# EAGLE design PCB_Cajero_10 (EAGLE 8.6.3)
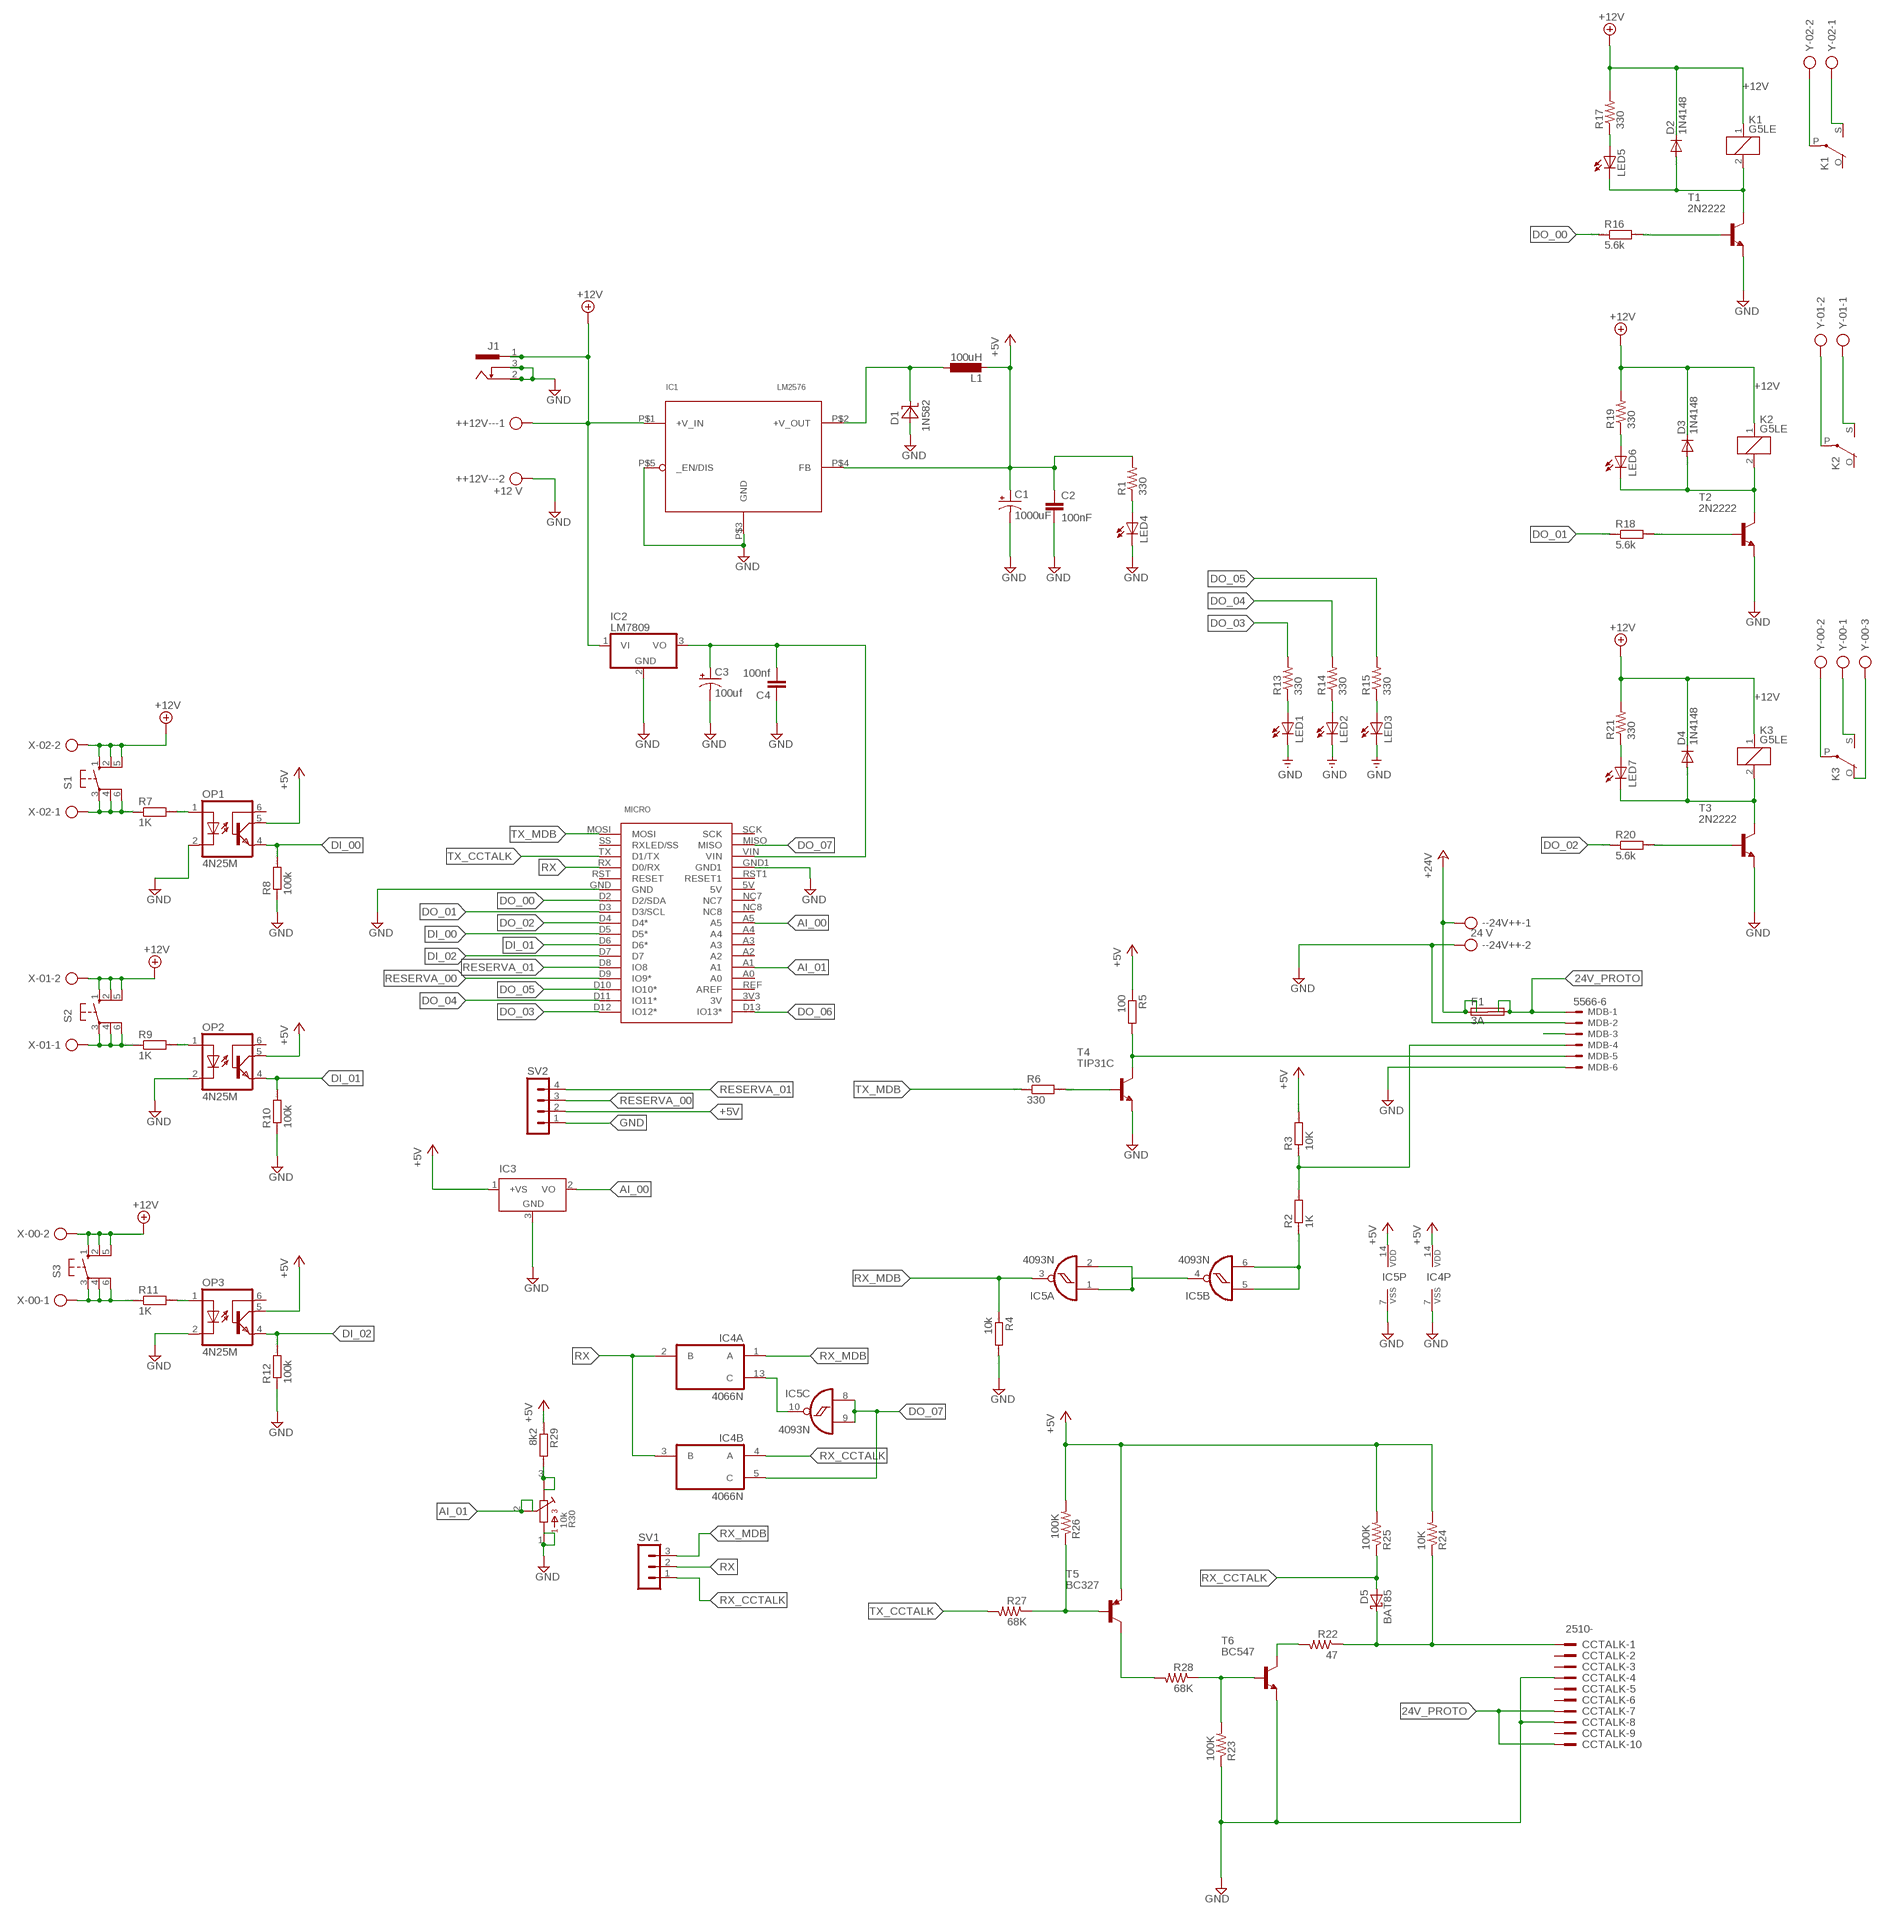
[diagram p0: schematic, sheet 1]

## Parts
++12V--  +12 V  AK500/2  [AK500/2]
--24V++  24 V  AK500/2  [AK500/2]
C1  1000uF  CPOL-USE5-5  [E5-5]
C2  100nF  C2,5-3  [C2.5-3]
C3  100uf  CPOL-USE2.5-6  [E2,5-6]
C4  100nf  C2,5-3  [C2.5-3]
CCTALK  2510-  [PAK100/2500-10]
D1  1N582  [1N582*]
D2  1N4148  1N4148DO35-7  [DO35-7]
D3  1N4148  1N4148DO35-7  [DO35-7]
D4  1N4148  1N4148DO35-7  [DO35-7]
D5  BAT85  [SOD68]
F1  3A  SHK20L  [SHK20L]
IC1  LM2576  LM2576-T05E  [TO220_SEP]
IC2  LM7809  [TO-220V]
IC3  LM35CZ  [TO92]
IC4  4066N  [DIL14]
IC5  4093N  [DIL14]
J1  KLDVX-0202-A  [KLDVX-0202-A]
K1  G5LE  [G5LE]
K2  G5LE  [G5LE]
K3  G5LE  [G5LE]
L1  100uH  DO3316P  [DO3316P]
LED1  LED5MM  [LED5MM]
LED2  LED5MM  [LED5MM]
LED3  LED5MM  [LED5MM]
LED4  LED5MM  [LED5MM]
LED5  LED5MM  [LED5MM]
LED6  LED5MM  [LED5MM]
LED7  LED5MM  [LED5MM]
MDB  5566-6  [5566-6]
MICRO  ARDUINO_MICROFOOTPRINT  [ARDUINO-MICRO]
OP1  4N25M  [DIL06]
OP2  4N25M  [DIL06]
OP3  4N25M  [DIL06]
R1  330  R-US_0207/7  [0207/7]
R2  1K  R0204/7  [0204/7]
R3  10K  R0204/7  [0204/7]
R4  10k  R0204/7  [0204/7]
R5  100  R-EU_0309/10  [0309/10]
R6  330  R0204/7  [0204/7]
R7  1K  R0204/7  [0204/7]
R8  100k  R0204/7  [0204/7]
R9  1K  R0204/7  [0204/7]
R10  100k  R0204/7  [0204/7]
R11  1K  R0204/7  [0204/7]
R12  100k  R0204/7  [0204/7]
R13  330  R-US_0207/7  [0207/7]
R14  330  R-US_0207/7  [0207/7]
R15  330  R-US_0207/7  [0207/7]
R16  5.6k  R0204/7  [0204/7]
R17  330  R-US_0207/7  [0207/7]
R18  5.6k  R0204/7  [0204/7]
R19  330  R-US_0207/7  [0207/7]
R20  5.6k  R0204/7  [0204/7]
R21  330  R-US_0207/7  [0207/7]
R22  47  R-US_0204/7  [0204/7]
R23  100K  R-US_0204/7  [0204/7]
R24  10K  R-US_0204/7  [0204/7]
R25  100K  R-US_0204/7  [0204/7]
R26  100K  R-US_0204/7  [0204/7]
R27  68K  R-US_0204/7  [0204/7]
R28  68K  R-US_0204/7  [0204/7]
R29  8k2  R0204/7  [0204/7]
R30  10k  3386  [3386-MULTI]
S1  10-XX  [B3F-10XX]
S2  10-XX  [B3F-10XX]
S3  10-XX  [B3F-10XX]
SV1  MA03-1  [MA03-1]
SV2  MA04-1  [MA04-1]
T1  2N2222  [TO18]
T2  2N2222  [TO18]
T3  2N2222  [TO18]
T4  TIP31C  [TO-220V]
T5  BC327  [TO92]
T6  BC547  [TO92]
X-00  AK500/2  [AK500/2]
X-01  AK500/2  [AK500/2]
X-02  AK500/2  [AK500/2]
Y-00  AK500/3  [AK500/3]
Y-01  AK500/2  [AK500/2]
Y-02  AK500/2  [AK500/2]

## Nets
24V_PROTO: CCTALK.7 CCTALK.10 F1.2A F1.2B MDB.1
+5V: C1.+ C2.1 IC1.P$4(FB) IC3.1(+VS) IC4.14(P:VDD) IC5.14(P:VDD) L1.1 OP1.5(COL) OP2.5(COL) OP3.5(COL) R1.2 R3.2 R5.1 R24.2 R25.2 R26.2 R29.1 SV2.2 T5.1(E)
+12V: ++12V--.1 D2.C D3.C D4.C IC1.P$1(+V_IN) IC2.1(VI) J1.1 J1.1@1 K1.1 K2.1 K3.1 R17.2 R19.2 R21.2 S1.1(S) S1.2(S1) S1.5(S2) S2.1(S) S2.2(S1) S2.5(S2) S3.1(S) S3.2(S1) S3.5(S2) X-00.2 X-01.2 X-02.2
+24V: --24V++.1 F1.1A F1.1B
AI_00: IC3.2(VO) MICRO.A5
AI_01: MICRO.A1 R30.2 R30.5
DI_00: MICRO.D5(D5*) OP1.4(EMI) R8.2
DI_01: MICRO.D6(D6*) OP2.4(EMI) R10.2
DI_02: MICRO.D7 OP3.4(EMI) R12.2
DO_00: MICRO.D2(D2/SDA) R16.1
DO_01: MICRO.D3(D3/SCL) R18.1
DO_02: MICRO.D4(D4*) R20.1
DO_03: MICRO.D12(IO12*) R13.2
DO_04: MICRO.D11(IO11*) R14.2
DO_05: MICRO.D10(IO10*) R15.2
DO_06: MICRO.D13(IO13*)
DO_07: IC4.5(B:C) IC5.8(C:I0) IC5.9(C:I1) MICRO.MISO
GND: ++12V--.2 --24V++.2 C1.- C2.2 C3.- C4.1 CCTALK.4 CCTALK.8 D1.A IC1.P$3(GND) IC1.P$5(_EN/DIS) IC2.2(GND) IC3.3(GND) IC4.7(P:VSS) IC5.7(P:VSS) J1.2 J1.2@1 J1.3 J1.3@1 LED1.K(C) LED2.K(C) LED3.K(C) LED4.K(C) MDB.2 MDB.6 MICRO.GND MICRO.GND1 OP1.2(C) OP2.2(C) OP3.2(C) R4.2 R8.1 R10.1 R12.1 R23.1 R30.1 R30.4 SV2.1 T1.1(E) T2.1(E) T3.1(E) T4.3(E) T6.1(E)
N$1: C3.+ C4.2 IC2.3(VO) MICRO.VIN
N$2: R7.1 S1.3(P) S1.4(P1) S1.6(P2) X-02.1
N$3: R9.1 S2.3(P) S2.4(P1) S2.6(P2) X-01.1
N$4: D3.A K2.2 LED6.K(C) T2.3(C)
N$5: K2.P(2:P) Y-01.2
N$7: MDB.3
N$8: LED4.A R1.1
N$9: D1.C IC1.P$2(+V_OUT) L1.2
N$10: LED5.A R17.1
N$11: OP1.1(A) R7.2
N$12: K2.S(2:S) Y-01.1
N$13: LED1.A R13.1
N$14: LED2.A R14.1
N$15: LED3.A R15.1
N$16: R18.2 T2.2(B)
N$17: LED6.A R19.1
N$18: OP2.1(A) R9.2
N$19: R11.1 S3.3(P) S3.4(P1) S3.6(P2) X-00.1
N$20: R29.2 R30.3 R30.6
N$21: CCTALK.1 D5.C(K) R22.1 R24.1
N$22: OP3.1(A) R11.2
N$23: R16.2 T1.2(B)
N$25: IC5.1(A:I0) IC5.2(A:I1) IC5.4(B:O)
N$26: D4.A K3.2 LED7.K(C) T3.3(C)
N$27: D2.A K1.2 LED5.K(C) T1.3(C)
N$28: K1.P(2:P) Y-02.2
N$29: K1.S(2:S) Y-02.1
N$30: R22.2 T6.3(C)
N$31: K3.P(2:P) Y-00.2
N$32: R23.2 R28.1 T6.2(B)
N$33: R28.2 T5.3(C)
N$34: MDB.5 R5.2 T4.2(C)
N$35: R6.2 T4.1(B)
N$36: IC5.5(B:I0) IC5.6(B:I1) R2.1
N$37: MDB.4 R2.2 R3.1
N$38: K3.S(2:S) Y-00.1
N$39: R26.1 R27.1 T5.2(B)
N$40: R20.2 T3.2(B)
N$41: LED7.A R21.1
N$42: IC4.13(A:C) IC5.10(C:O)
N$44: K3.O(2:O) Y-00.3
RESERVA_00: MICRO.D9(IO9*) SV2.3
RESERVA_01: MICRO.D8(IO8) SV2.4
RX: IC4.2(A:B) IC4.3(B:B) MICRO.RX(D0/RX) SV1.2
RX_CCTALK: D5.A IC4.4(B:A) R25.1 SV1.1
RX_MDB: IC4.1(A:A) IC5.3(A:O) R4.1 SV1.3
TX_CCTALK: MICRO.TX(D1/TX) R27.2
TX_MDB: MICRO.MOSI R6.1
Unconnected: CCTALK.2 CCTALK.3 CCTALK.5 CCTALK.6 CCTALK.9 IC4.6(C:C) IC4.8(C:A) IC4.9(C:B) IC4.10(D:B) IC4.11(D:A) IC4.12(D:C) IC5.11(D:O) IC5.12(D:I0) IC5.13(D:I1) K1.O(2:O) K2.O(2:O) MICRO.3V3(3V) MICRO.5V MICRO.A0 MICRO.A2 MICRO.A3 MICRO.A4 MICRO.NC7 MICRO.NC8 MICRO.REF(AREF) MICRO.RST1(RESET1) MICRO.RST(RESET) MICRO.SCK MICRO.SS(RXLED/SS) OP1.6(BAS) OP2.6(BAS) OP3.6(BAS)

## Library data of the parts
++12V-- --24V++ X-00 X-01 X-02 Y-01 Y-02 = con-ptr500:AK500/2: CONNECTOR; OC_FARNELL: unknown; OC_NEWARK: unknown
C1 = rcl:CPOL-US: POLARIZED CAPACITOR, American symbol; SPICEPREFIX: C
C2 C4 = capacitor-wima:C: CAPACITOR naming: grid - package width
C3 = adafruit:CPOL-US: POLARIZED CAPACITOR, American symbol
CCTALK = con-3m:2510-: 3M (TM) Pak 100 4-Wall Header Source: 3M; MF: 3M; MPN: 2510-6002UB; OC_FARNELL: 9838244; OC_NEWARK: 46F4725
D1 = MOD:1N582*
D2-D4 = diode:1N4148: DIODE high speed (Philips)
D5 = nxp_60:BAT85: Schottky barrier diode Planar Schottky barrier diode with an integrated protection ring against static discharges, encapsulated in a hermetically-sealed subminiature SOD68 (DO-34) package. The diode is suitable for mounting on a 2 E (5.08 mm) pitch. AAL Eindhoven MK
F1 = fuse:SHK20L: FUSE HOLDER 5 x 20 mm, SH contact, SHH1 Schukat, E1073 Buerklin; OC_FARNELL: unknown; OC_NEWARK: unknown
IC1 = LM2576_MOD:LM2576-T05E
IC2 = MOD:LM7809
IC3 = lm35:LM35: Single-Supply Centigrade Temperature Sensor Vout = (10mV/°C x Temp °C) +5mmmV Source: http://www.national.com/ds/LM/LM35.pdf
IC4 = 40xx:4066: Quad bilateral ANALOG SWITCH
IC5 = 40xx:4093: Quad 2-input NAND schmitt trigger; SPICEPREFIX: J
J1 = con-kycon:KLDVX-0202-: Power Jack, Vertical, PCB Mount, 2.0 mm, 2.5 mm, 3.0 mm Center Pin Source: KLDVX-0202x.pdf; OC_FARNELL: unknown; OC_NEWARK: unknown
K1-K3 = relay:G5LE: RELAY 1 x switch, 10 A/120 V AC, 8 A/30 V DC, Omron; OC_FARNELL: unknown; OC_NEWARK: unknown
L1 = MOD:DO3316P: COILCRAFT; OC_FARNELL: unknown; OC_NEWARK: unknown
LED1-LED7 = adafruit:LED: LED OSRAM: - CHIPLED LG R971, LG N971, LY N971, LG Q971, LY Q971, LO R971, LY R971 LH N974, LH R974 LS Q976, LO Q976, LY Q976 LO Q996 - Hyper CHIPLED LW Q18S LB Q993, LB Q99A, LB R99A - SideLED LS A670, LO A670, LY A670, LG A670, LP A670 LB A673, LV A673, LT A673, LW A673 LH A674 LY A675 LS A676, LA A676, LO A676, LY A676, LW A676 LS A679, LY A679, LG A679 - Hyper Micro SIDELED® LS Y876, LA Y876, LO Y876, LY Y876 LT Y87S - SmartLED LW L88C, LW L88S LB L89C, LB L89S, LG L890 LS L89K, LO L89K, LY L89K LS L896, LA L896, LO L896, LY L896 - TOPLED LS T670, LO T670, LY T670, LG T670, LP T670 LSG T670, LSP T670, LSY T670, LOP T670, LYG T670 LG T671, LOG T671, LSG T671 LB T673, LV T673, LT T673, LW T673 LH T674 LS T676, LA T676, LO T676, LY T676, LB T676, LH T676, LSB T676, LW T676 LB T67C, LV T67C, LT T67C, LS T67K, LO T67K, LY T67K, LW E67C LS E67B, LA E67B, LO E67B, LY E67B, LB E67C, LV E67C, LT E67C LW T67C LS T679, LY T679, LG T679 LS T770, LO T770, LY T770, LG T770, LP T770 LB T773, LV T773, LT T773, LW T773 LH T774 LS E675, LA E675, LY E675, LS T675 LS T776, LA T776, LO T776, LY T776, LB T776 LHGB T686 LT T68C, LB T68C - Hyper Mini TOPLED® LB M676 - Mini TOPLED Santana® LG M470 LS M47K, LO M47K, LY M47K Source: http://www.osram.convergy.de/
MDB = MOD:5566-6: Mini FIT connector 6 pol Source: http://www.molex.com; MF: MOLEX; MPN: 95566-61002; OC_FARNELL: unknown; OC_NEWARK: 22K8620
MICRO = arduino-micro:ARDUINO_MICRO
OP1-OP3 = optocoupler:4N*?M: General Purpose 6-Pin Phototransistor Optocouplers Source: http://www.fairchildsemi.com/ds/4N/4N35-M.pdf; MPN: 4N25-M; OC_FARNELL: 1021349; OC_NEWARK: 98K9084
R1 R13-R15 R17 R19 R21-R28 = rcl:R-US_: RESISTOR, American symbol; SPICEPREFIX: R
R2-R4 R6-R12 R16 R18 R20 R29 = eagle-ltspice:R: RESISTOR, European symbol; SPICEMODEL: NONE; SPICEPREFIX: R
R5 = rcl:R-EU_: RESISTOR, European symbol; SPICEPREFIX: R
R30 = bourns:3386: 3386 Series 3/8" Square Trimmer (Multi-Package F,P,K & Y)
S1-S3 = MOD:10-XX: OMRON SWITCH; MPN: B3F-1000; OC_FARNELL: 176432; OC_NEWARK: 36M3542
SV1 = con-lstb:MA03-1: PIN HEADER; OC_FARNELL: unknown; OC_NEWARK: unknown
SV2 = con-lstb:MA04-1: PIN HEADER; OC_FARNELL: unknown; OC_NEWARK: unknown
T1-T3 = transistor-neu-to92:2N2222: NPN TRANSISTOR
T4 = MOD:TIP31C
T5 = transistor-pnp:BC327: PNP Transistor
T6 = transistor:BC547: NPN TRANSISTOR
Y-00 = con-ptr500:AK500/3: CONNECTOR; OC_FARNELL: unknown; OC_NEWARK: unknown

## Board
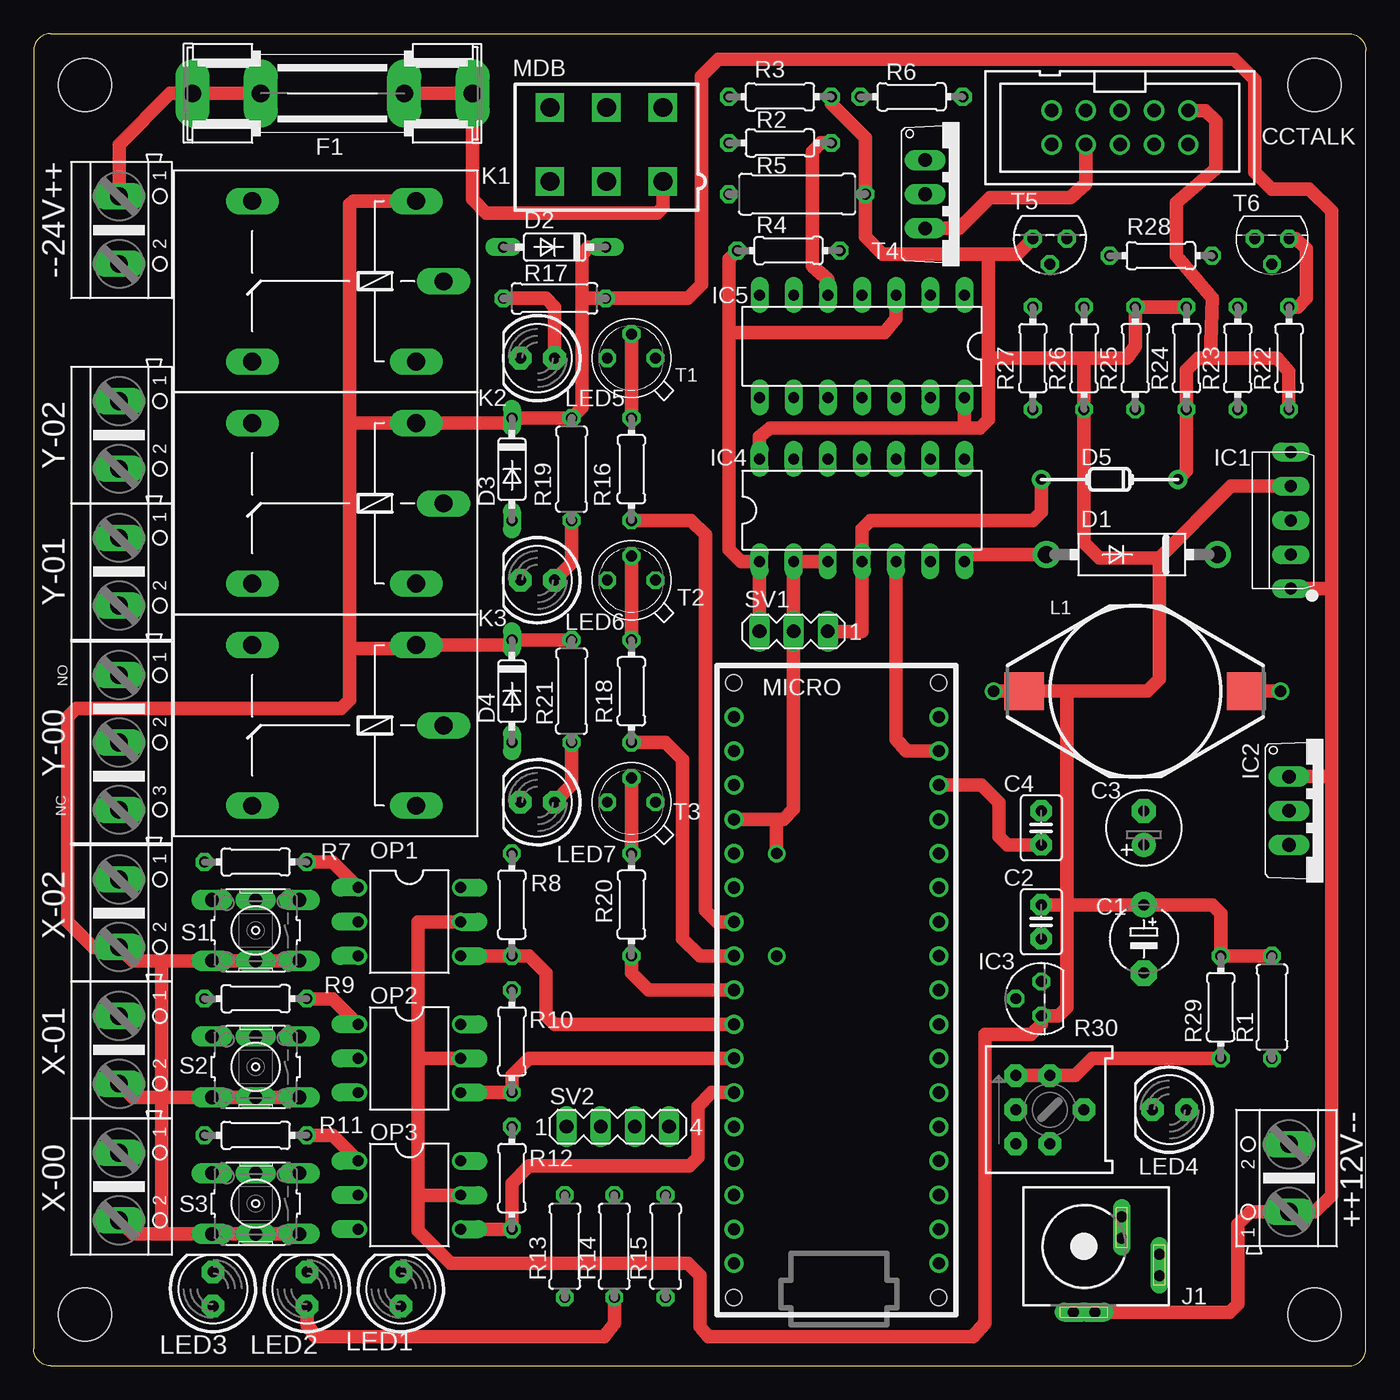
[diagram p1: board, top side]
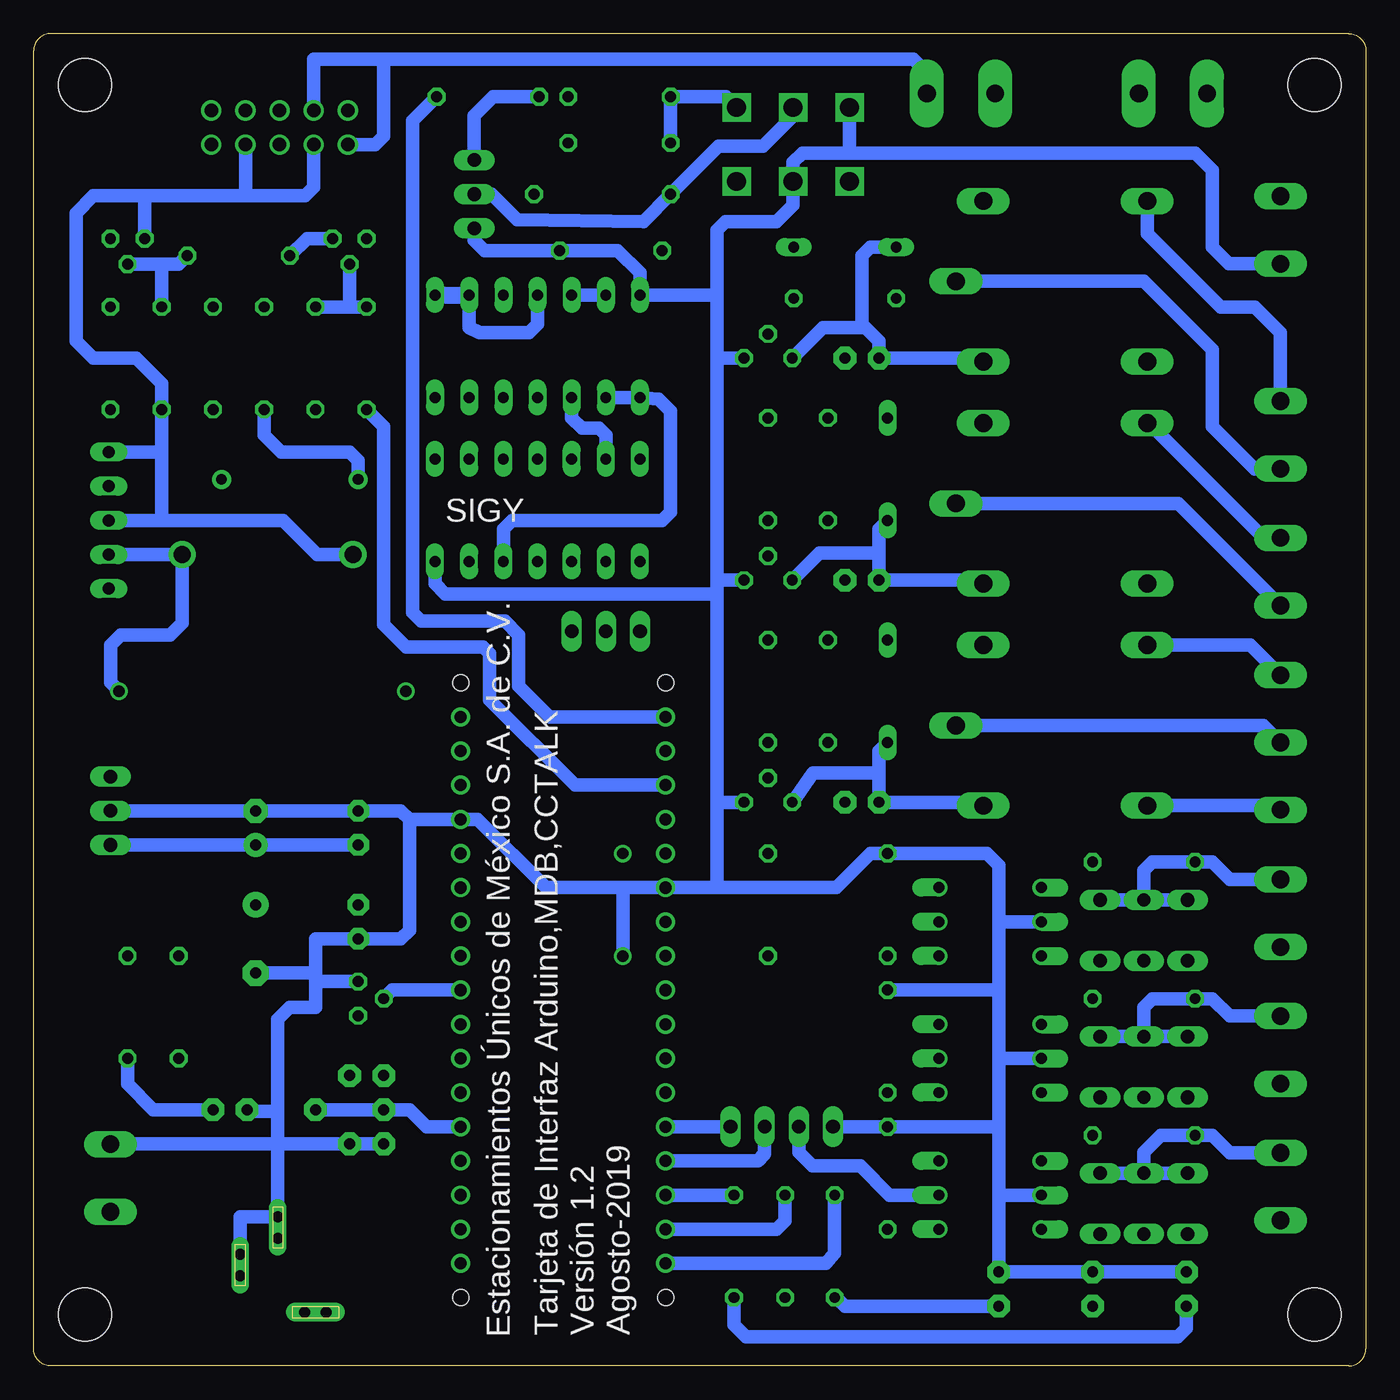
[diagram p2: board, bottom side, seen from below]

Size 99.06 x 99.06 mm. Coordinates in mm from the lower left corner, seen from the top.
Outline: 1.27,0 97.79,0 arc90 99.06,1.27 99.06,97.79 arc90 97.79,99.06 1.27,99.06 arc90 0,97.79 0,1.27 arc90 1.27,0
Copper layers (1*16): Top 0.035mm / dielectric 1.5mm / Bottom 0.035mm
Design rules "default": minimum track width 6mil, minimum drill 0.35mm, track to track 6mil, track to pad 6mil, pad to pad 6mil, via to via 6mil, smd to smd 6mil, copper to edge 40mil, drill to drill 6mil, minimum pad ring 10mil, minimum via ring 8mil, stop-mask expansion 4mil, vias tented up to drill 0mil, thermal gap 10mil
Holes 3.97 mm at 3.81,95.25 95.25,95.25 95.25,3.81 3.81,3.81

### Footprints (pad centres in the part's own frame; a part is rotated, then mirrored left to right if it is on the bottom)
AK500/2 = drill 1.321 long: 1 -2.515,0; 2 2.515,0
E5-5 = drill 0.813 pad 1.905: + -2.54,0 | drill 0.813 pad 1.905 octagon: - 2.54,0
C2.5-3 = drill 0.813 pad 1.6 octagon: 1 -1.27,0; 2 1.27,0
E2,5-6 = drill 0.813 pad 1.778: + -1.27,0 | drill 0.813 pad 1.778 octagon: - 1.27,0
PAK100/2500-10 = drill 1 pad 1.422: 1 -5.08,-1.27; 2 -5.08,1.27; 3 -2.54,-1.27; 4 -2.54,1.27; 5 0,-1.27; 6 0,1.27; 7 2.54,-1.27; 8 2.54,1.27; 9 5.08,-1.27; 10 5.08,1.27
1N582* = drill 1.27 pad 2.032: A 5.08,0; C -7.62,0
DO35-7 = drill 0.813 long: A 3.81,0; C -3.81,0
SOD68 = drill 0.8 pad 1.422: A -5.08,0; C 5.08,0
SHK20L = drill 1.321 pad 2.54 long: 1A -10.414,0; 1B -5.334,0; 2A 10.414,0; 2B 5.334,0
TO220_SEP = drill 0.889 pad 1.219 long: P$1 -5.08,0; P$2 -2.54,0; P$3 0,0; P$4 2.54,0; P$5 5.08,0
TO-220V = drill 1.016 long: 1 -2.54,0; 2 0,0; 3 2.54,0
TO92 = drill 0.813 octagon: 1 -1.27,0; 2 0,1.905; 3 1.27,0
DIL14 = drill 0.813 long: 1 -7.62,-3.81; 2 -5.08,-3.81; 3 -2.54,-3.81; 4 0,-3.81; 5 2.54,-3.81; 6 5.08,-3.81; 7 7.62,-3.81; 8 7.62,3.81; 9 5.08,3.81; 10 2.54,3.81; 11 0,3.81; 12 -2.54,3.81; 13 -5.08,3.81; 14 -7.62,3.81
KLDVX-0202-A = drill 0.8 pad 1.4 long: 1 -4.9,0.8; 1@1 -4.9,-0.8 | drill 0.8 pad 1.3 long: 2 -2.2,-5.6; 2@1 -0.6,-5.6; 3 0.6,-2.8; 3@1 2.2,-2.8
G5LE = drill 1.321 long: 1 -7.493,-5.969; 2 -7.493,5.969; O 4.699,5.969; P -9.525,0; S 4.699,-5.969
DO3316P = smd 2.92 x 2.79: 1 -8.255,0; 2 8.255,0
LED5MM = drill 0.813 pad 1.676 octagon: A -1.27,0; K 1.27,0
5566-6 = drill 1.4 square: 1 4.2,-2.75; 2 0,-2.75; 3 -4.2,-2.75; 4 4.2,2.75; 5 0,2.75; 6 -4.2,2.75
ARDUINO-MICRO = drill 0.9: 3V3 16.51,3.81; 5V 16.51,29.21; A0 16.51,8.89; A1 16.51,11.43; A2 16.51,13.97; A3 16.51,16.51; A4 16.51,19.05; A5 16.51,21.59; D2 1.27,26.67; D3 1.27,24.13; D4 1.27,21.59; D5 1.27,19.05; D6 1.27,16.51; D7 1.27,13.97; D8 1.27,11.43; D9 1.27,8.89; D10 1.27,6.35; D11 1.27,3.81; D12 1.27,1.27; D13 16.51,1.27; GND 1.27,29.21; GND1 16.51,34.29; MISO 16.51,39.37; MOSI 1.27,41.91; NC7 16.51,26.67; NC8 16.51,24.13; REF 16.51,6.35; RST 1.27,31.75; RST1 16.51,31.75; RX 1.27,34.29; SCK 16.51,41.91; SS 1.27,39.37; TX 1.27,36.83; VIN 16.51,36.83 | hole 1.2: 1.27,-1.27; 16.51,-1.27; 1.27,44.45; 16.51,44.45
DIL06 = drill 0.813 offset: 1 -2.54,-3.81; 2 0,-3.81; 3 2.54,-3.81; 4 2.54,3.81; 5 0,3.81; 6 -2.54,3.81
0207/7 = drill 0.813 octagon: 1 -3.81,0; 2 3.81,0
0204/7 = drill 0.813 octagon: 1 -3.81,0; 2 3.81,0
0309/10 = drill 0.813 octagon: 1 -5.08,0; 2 5.08,0
3386-MULTI = drill 0.813 pad 1.676 octagon: 1 -2.54,0; 2 0,-2.54; 3 2.54,0; 4 -2.54,2.54; 5 0,2.54; 6 2.54,2.54
B3F-10XX = drill 1.016 long: 1 -3.251,2.261; 2 3.251,2.261; 3 -3.251,-2.261; 4 3.251,-2.261 | drill 1 long: 5 0,2.261; 6 0,-2.261
MA03-1 = drill 1.016 long: 1 -2.54,0; 2 0,0; 3 2.54,0
MA04-1 = drill 1.016 long: 1 -3.81,0; 2 -1.27,0; 3 1.27,0; 4 3.81,0
TO18 = drill 0.813 octagon: 1 -1.27,-1.27; 2 1.27,-1.27; 3 1.27,1.27
TO92' = drill 0.813 octagon: 1 1.27,0; 2 0,1.905; 3 -1.27,0
AK500/3 = drill 1.321 long: 1 -5.004,0; 2 0,0; 3 5.004,0

### Placement (x,y rotation side)
++12V--  93.34,13.97 90 top
--24V++  6.35,84.45 270 top
C1  82.55,31.75 270 top
C2  74.93,33.02 270 top
C3  82.55,40.01 90 top
C4  74.93,40.01 270 top
CCTALK  80.77,92.08 180 top
D1  80.39,60.33 180 top
D2  38.73,83.19 180 top
D3  35.56,66.67 270 top
D4  35.56,50.16 270 top
D5  80.01,65.91 0 top
F1  22.23,94.61 0 top
IC1  93.47,62.87 90 top
IC2  93.34,41.27 270 top
IC3  74.93,27.3 90 top
IC4  61.59,63.63 0 top
IC5  61.59,75.82 180 top
J1  78.11,8.89 90 top
K1  20.95,80.64 180 top
K2  20.95,64.14 180 top
K3  20.95,47.62 180 top
L1  81.92,50.16 0 top
LED1  27.3,5.71 90 top
LED2  20.32,5.71 90 top
LED3  13.34,5.71 90 top
LED4  84.45,19.05 180 top
LED5  37.47,74.93 180 top
LED6  37.47,58.42 180 top
LED7  37.47,41.91 180 top
MDB  42.59,90.81 0 top
MICRO  50.8,6.35 0 top
OP1  27.94,33.02 270 top
OP2  27.94,22.86 270 top
OP3  27.94,12.7 270 top
R1  92.08,26.67 90 top
R2  55.5,90.93 180 top
R3  55.5,94.36 0 top
R4  56.13,82.93 0 top
R5  56.77,87.12 180 top
R6  65.28,94.36 180 top
R7  16.51,37.47 0 top
R8  35.56,34.29 270 top
R9  16.51,27.3 0 top
R10  35.56,24.13 270 top
R11  16.51,17.14 0 top
R12  35.56,13.97 270 top
R13  39.5,8.89 90 top
R14  43.18,8.89 90 top
R15  46.99,8.89 90 top
R16  44.45,66.67 90 top
R17  38.73,79.38 0 top
R18  44.45,50.16 90 top
R19  40.01,66.67 90 top
R20  44.45,34.29 90 top
R21  40.01,50.16 90 top
R22  93.34,74.93 90 top
R23  89.53,74.93 90 top
R24  85.72,74.93 90 top
R25  81.92,74.93 90 top
R26  78.11,74.93 270 top
R27  74.3,74.93 270 top
R28  83.82,82.55 180 top
R29  88.27,26.67 270 top
R30  75.56,19.05 90 top
S1  16.51,32.38 180 top
S2  16.51,22.23 180 top
S3  16.51,12.06 180 top
SV1  56.52,54.61 180 top
SV2  43.43,17.78 0 top
T1  44.45,74.93 135 top
T2  44.45,58.42 135 top
T3  44.45,41.91 135 top
T4  66.29,87.12 270 top
T5  BC327  [TO92']  75.56,83.82 180 top
T6  BC547  [TO92']  92.08,83.82 180 top
X-00  6.35,13.34 270 top
X-01  6.35,23.5 270 top
X-02  6.35,33.66 270 top
Y-00  6.35,46.35 270 top
Y-01  6.35,59.05 270 top
Y-02  6.35,69.22 270 top

### Tracks (layer width: path | path; a pad name or v marks a point on that pad's centre or on a via)
24V_PROTO
  Top 1.016: MDB.1 46.79,86.16 46.35,85.72 33.66,85.72 32.64,86.74 F1.2A F1.2B
  Bottom 1.016: CCTALK.10 73.66,90.81 73.03,91.44 73.03,97.16 | CCTALK.7 78.23,97.16 73.03,97.16 | F1.2A 32.64,96.14 33.66,97.16 73.03,97.16
+5V  (via drill 0.85 pad 1.3)
  Top 1.016: C2.1 76.83,34.29 | 76.83,34.29 76.83,26.67 76.2,26.04 IC3.1 74.93,25.4 74.17,24.64 70.74,24.64 70.74,3.17 69.85,2.16 50.16,2.16 49.53,2.92 49.53,6.73 48.64,7.62 30.99,7.62 28.57,10.03 28.57,12.7 | 76.83,34.29 76.83,50.16 | 76.83,50.16 L1.1 v71.37,50.16 | R1.2 R29.1 88.27,33.66 87.63,34.29 C1.+ 76.83,34.29 | OP3.5 28.57,12.7 | 28.57,12.7 28.57,22.86 | 28.57,22.86 28.57,33.02 OP1.5 | OP2.5 28.57,22.86 | R3.2 59.31,93.85 61.85,91.31 R5.1 61.85,83.95 63.12,82.68 71.12,82.68 | 71.12,82.68 73.15,82.68 T5.1 | IC4.14 53.98,69.09 54.74,69.72 69.22,69.72 | 71.12,82.68 70.99,82.55 70.99,74.8 | 70.99,74.8 70.99,70.36 70.36,69.72 69.22,69.72 | 78.11,74.93 81.28,74.93 81.92,75.82 R25.2 R24.2 | 78.11,74.93 R26.2 78.11,61.21 79.25,60.07 83.69,60.07 | IC1.P$4 89.03,65.41 83.69,60.07 | 83.69,60.07 83.69,51.05 82.8,50.16 76.83,50.16 | IC5.14 69.22,69.72 | 70.99,74.8 71.12,74.93 78.11,74.93
  Bottom 1.016: SV2.2 42.16,15.88 41.15,14.86 37.59,14.86 35.43,12.7 OP3.5
+12V
  Top 1.016: D3.C R19.2 40.77,71.25 40.77,79.38 | D3.C 35.81,70.74 | 96.52,43.69 96.52,12.7 95.28,11.46 ++12V--.1 90.45,11.46 89.53,10.54 89.53,4.57 88.95,3.99 J1.1@1 J1.1 | 96.52,43.69 96.52,57.78 | 96.52,57.78 96.52,85.85 94.87,87.5 92.08,87.5 90.81,88.77 90.81,95.63 89.28,97.16 50.93,97.16 49.66,95.89 49.66,80.39 48.64,79.38 R17.2 40.77,79.38 | S3.1 S3.5 S3.2 9.53,9.8 | S2.1 S2.5 S2.2 9.53,19.96 | S1.1 S1.5 S1.2 9.53,30.12 | R21.2 D4.C 35.81,53.59 K3.1 28.19,53.34 23.5,53.34 | 9.53,30.12 7.37,30.12 X-02.2 4.47,31.14 4.45,31.11 2.54,33.02 2.54,48.26 3.17,48.9 22.86,48.9 23.5,49.53 23.5,53.34 | 9.53,30.12 9.53,19.96 | 9.53,19.96 9.53,9.8 | X-01.2 7.37,19.96 9.53,19.96 | X-00.2 7.37,9.8 9.53,9.8 | D3.C 35.18,70.1 K2.1 23.75,70.1 23.5,69.85 | K1.1 23.75,86.61 23.5,86.36 23.5,69.85 | 23.5,53.34 23.5,69.85 | 40.77,79.38 40.77,82.68 41.27,83.19 D2.C | IC1.P$1 96.52,57.78 | IC2.1 96.39,43.81 96.52,43.69
+24V
  Top 1.016: --24V++.1 6.35,90.81 10.16,94.61 F1.1A F1.1B
AI_00
  Bottom 1.016: IC3.2 72.39,27.94 MICRO.A5
AI_01
  Bottom 1.016: MICRO.A1 69.85,17.78 71.12,19.05 R30.5 R30.2
DI_00
  Top 1.016: OP1.4 R8.2 36.83,30.48 38.1,29.21 38.1,26.04 38.73,25.4 MICRO.D5
DI_01
  Top 1.016: OP2.4 R10.2 35.56,21.59 36.83,22.86 MICRO.D6
DI_02
  Top 1.016: OP3.4 R12.2 35.56,13.59 36.83,14.86 48.77,14.86 49.4,15.49 49.4,19.3 50.42,20.32 MICRO.D7
DO_00
  Top 1.016: MICRO.D2 50.8,33.02 49.95,33.87 49.95,61.81 48.9,62.87 R16.1
DO_01
  Top 1.016: MICRO.D3 49.53,30.48 48.26,31.75 48.26,45.09 46.99,46.35 R18.1
DO_02
  Top 1.016: MICRO.D4 45.72,27.94 44.45,29.21 R20.1
DO_03
  Bottom 1.016: MICRO.D12 40.13,7.62 39.5,8.38 R13.2
DO_04
  Bottom 1.016: MICRO.D11 43.81,10.16 43.18,10.79 R14.2
DO_05
  Bottom 1.016: MICRO.D10 R15.2
DO_07
  Top 1.016: MICRO.MISO 64.9,45.72 64.14,46.61 IC4.5
  Bottom 1.016: IC5.9 IC5.8 52.58,71.88 51.69,70.99 51.69,63.5 52.32,62.87 63.5,62.87 64.14,62.23 IC4.5
GND  (via drill 0.85 pad 1.3)
  Top 1.016: D1.A 69.72,60.33 IC4.7 | T4.3 68.83,84.58 71.12,86.87 77.09,86.87 78.23,87.88 CCTALK.8
  Bottom 0.152: 82.5,11.09 82.55,11.13
  Bottom 1.016: ++12V--.2 93.32,16.51 80.91,16.51 | 78.11,28.57 IC3.3 | 78.11,28.57 78.11,26.67 80.01,26.67 80.91,25.77 80.91,18.92 | IC2.2 C3.- C4.1 71.75,41.27 71.12,40.64 | 78.11,28.57 78.11,29.21 | 78.11,29.21 78.11,31.75 C2.2 71.75,31.75 71.12,32.38 71.12,40.64 | J1.3@1 J1.3 | J1.2 J1.2@1 83.7,11.09 82.5,11.09 J1.3@1 | J1.3@1 80.91,16.51 | 80.91,16.51 80.91,18.92 | R30.4 R30.1 80.91,16.51 | OP3.2 27.3,12.7 | 27.3,27.94 27.3,33.02 | OP1.2 27.3,33.02 | R10.1 27.3,27.94 | 27.3,17.78 R12.1 SV2.1 | 27.3,12.7 27.3,17.78 | 27.3,17.78 27.3,22.86 | 27.3,22.86 27.3,27.94 | OP2.2 27.3,22.86 | 27.3,33.02 27.3,37.21 28.19,38.1 R8.1 36.83,38.1 39.37,35.56 48.26,35.56 | --24V++.2 10.19,81.94 11.43,83.19 11.43,88.9 12.7,90.17 38.39,90.17 | 38.39,90.17 41.91,90.17 42.59,89.49 MDB.2 42.59,86.32 43.81,85.09 47.62,85.09 48.26,84.45 48.26,79.63 | MDB.6 38.39,90.17 | 48.26,74.93 48.26,79.63 | 48.26,58.42 48.26,74.93 | T1.1 48.26,74.93 | LED3.K LED2.K LED1.K 27.3,12.7 | T3.1 48.26,41.91 | 48.26,41.91 48.26,35.56 | 48.26,41.91 48.26,57.28 | 48.26,57.28 48.26,58.42 | 48.26,35.56 MICRO.GND 55.24,35.56 | T2.1 48.26,58.42 | 71.12,40.64 MICRO.GND1 66.04,40.64 60.96,35.56 55.24,35.56 | IC4.7 69.22,58.17 68.45,57.4 48.39,57.4 48.26,57.28 | 48.26,79.63 IC5.7 53.98,81.28 55.63,82.93 R4.2 65.53,82.93 66.29,83.69 T4.3 | D1.A 77.98,60.33 80.52,62.87 89.53,62.87 | CCTALK.8 78.23,87.63 78.87,87 83.31,87 | CCTALK.4 83.31,87 | 90.81,87 94.61,87 95.89,85.72 95.89,76.2 94.61,74.93 91.44,74.93 89.53,73.03 R23.1 89.53,67.94 | 90.81,87 83.31,87 | T6.1 90.81,87 | IC1.P$5 89.53,67.94 | IC1.P$3 89.53,62.87 | 89.53,67.94 89.53,62.87 | LED4.K 83.06,18.92 80.91,18.92 | C1.- 78.11,29.21
  Bottom 1.016: v55.24,30.48 55.24,35.56
N$1
  Top 1.016: C4.2 72.39,38.73 71.75,39.37 71.75,41.91 70.48,43.18 MICRO.VIN
  Bottom 1.016: C4.2 C3.+ IC2.3
N$2
  Bottom 1.016: S1.6 S1.4 | S1.6 S1.3 | X-02.1 10.13,36.17 11.43,37.47 R7.1 15.88,37.47 16.51,36.83 S1.6
N$3
  Bottom 1.016: S2.6 S2.3 | S2.6 S2.4 | X-01.1 10.13,26.01 11.43,27.3 R9.1 15.88,27.3 16.51,26.67 S2.6
N$4
  Bottom 1.016: K2.2 28.7,58.42 LED6.K 36.2,60.45 | T2.3 40.62,60.45 36.2,60.45 | 36.2,60.45 36.2,62.23 D3.A
N$5
  Bottom 1.016: Y-01.2 13.95,64.14 K2.P
N$8
  Bottom 1.016: LED4.A 90.17,19.05 92.08,20.95 R1.1
N$9  (via drill 0.85 pad 1.3)
  Top 1.016: L1.2 v92.71,50.16
  Bottom 1.016: v92.71,50.16 93.34,50.8 93.34,53.59 92.58,54.36 88.9,54.36 88.01,55.24 D1.C IC1.P$2
N$10
  Top 1.016: R17.1 38.1,79.38 38.73,78.74 LED5.A
N$11
  Top 1.016: R7.2 22.23,37.47 OP1.1
N$12
  Bottom 1.016: Y-01.1 6.38,61.59 7.62,61.59 16.13,70.1 K2.S
N$13
  Bottom 1.016: LED1.A 38.73,4.45 39.37,5.08 R13.1
N$14
  Top 1.016: LED2.A 20.32,3.05 20.95,2.16 42.42,2.16 43.18,3.17 R14.1
N$15
  Bottom 1.016: LED3.A 13.34,2.79 13.97,2.16 46.1,2.16 46.99,3.05 R15.1
N$16
  Top 1.016: T2.2 R18.2
N$17
  Top 1.016: R19.1 40.01,59.69 LED6.A
N$18
  Top 1.016: R9.2 22.23,27.3 OP2.1
N$19
  Bottom 1.016: S3.3 S3.6 | S3.6 S3.4 | X-00.1 10.13,15.85 11.43,17.14 R11.1 15.24,17.14 16.51,15.88 S3.6
N$20
  Top 1.016: R30.6 R30.3 77.47,21.59 78.74,22.86 R29.2
N$21
  Top 1.016: R22.1 93.34,73.91 92.46,74.93 87.63,74.93 | 87.63,74.93 86.61,74.93 85.72,74.04 R24.1 85.72,66.55 D5.C | CCTALK.1 87.12,93.34 87.88,92.58 87.88,89.03 84.96,86.49 84.96,82.55 87.63,79.38 87.5,75.06 87.63,74.93
N$22
  Top 1.016: R11.2 22.23,17.14 OP3.1
N$23
  Top 1.016: T1.2 R16.2
N$25
  Bottom 1.016: IC5.4 61.59,77.47 62.23,76.83 65.91,76.83 66.67,77.22 IC5.2
  Bottom 1.27: IC5.1 IC5.2
N$26
  Bottom 1.016: K3.2 28.7,41.91 LED7.K 36.2,44.07 | T3.3 41.13,44.07 36.2,44.07 | 36.2,44.07 36.2,45.72 D4.A
N$27
  Bottom 1.016: K1.2 28.7,74.93 LED5.K 36.2,76.2 37.21,77.22 37.47,77.22 | T1.3 40.37,77.22 37.47,77.22 | D2.A 36.83,83.19 37.47,82.55 37.47,77.22
N$28
  Bottom 1.016: Y-02.2 6.38,66.67 8.26,66.67 11.43,69.85 11.43,75.56 16.51,80.64 K1.P
N$29
  Bottom 1.016: Y-02.1 6.35,76.83 8.26,78.74 10.79,78.74 16.26,84.2 K1.S
N$30
  Top 1.016: T6.3 93.85,83.82 94.61,83.06 94.61,79.38 93.98,78.74 R22.2
N$31
  Bottom 1.016: Y-00.2 7.62,47.62 K3.P
N$32
  Bottom 1.016: T6.2 89.53,81.92 | 89.53,81.92 88.27,81.92 R28.1 | R23.2 89.53,81.92
N$33
  Bottom 1.016: T5.3 78.74,83.82 R28.2
N$34
  Bottom 1.016: MDB.5 42.59,92.92 44.83,90.68 48.13,90.68 R5.2 53.72,85.09 63.12,85.22 65.02,87.12 T4.2
N$35
  Bottom 1.016: T4.1 66.29,92.96 64.9,94.36 R6.2
N$36
  Top 1.016: IC5.5 59.05,80.77 57.91,81.79 57.91,90.3 58.55,90.93 R2.1
  Bottom 1.016: IC5.5 IC5.6
N$37
  Bottom 1.016: R2.2 R3.1 47.59,94.36 MDB.4
N$38
  Bottom 1.016: Y-00.1 8.59,53.59 K3.S
N$39
  Bottom 1.016: R26.1 75.56,78.74 | 75.56,78.74 R27.1 | T5.2 75.56,78.74
N$40
  Top 1.016: T3.2 R20.2
N$41
  Top 1.016: LED7.A 40.01,43.18 R21.1
N$42
  Bottom 1.016: IC5.10 59.05,70.48 58.29,69.72 57.02,69.72 56.52,69.22 IC4.13
N$44
  Bottom 1.016: K3.O 6.66,41.66 Y-00.3
RESERVA_00
  Bottom 1.016: MICRO.D9 45.21,15.24 44.7,15.75 SV2.3
RESERVA_01
  Bottom 1.016: SV2.4 MICRO.D8
RX  (via drill 0.85 pad 1.3)
  Top 1.016: IC4.3 IC4.2 SV1.2 56.52,41.4 55.75,40.64 55.24,40.64 | 55.24,40.64 MICRO.RX | v55.24,38.1 55.24,40.64
RX_CCTALK
  Top 1.016: SV1.1 61.59,54.61 IC4.4 61.59,62.23 62.23,62.87 74.3,62.87 74.93,63.5 D5.A
  Bottom 1.016: D5.A 74.93,67.31 75.56,67.94 80.64,67.94 81.92,69.22 R25.1
RX_MDB
  Top 1.016: SV1.3 IC4.1 52.58,59.82 51.69,60.71 51.69,76.83 | 51.69,76.83 51.69,82.3 R4.1 | IC5.3 64.14,77.85 63.25,76.83 51.69,76.83
TX_CCTALK
  Bottom 1.016: R27.2 73.03,69.85 73.03,55.12 71.37,53.47 65.66,53.47 65.15,52.96 65.15,49.53 58.8,43.18 MICRO.TX
TX_MDB
  Bottom 1.016: R6.1 70.87,92.58 70.87,56.01 70.23,55.37 64.01,55.37 62.99,54.36 62.99,50.55 60.71,48.26 MICRO.MOSI

### Text on the board
tNames: NO | NC
bNames: SIGY | Tarjeta de Interfaz Arduino,MDB,CCTALK / Versión 1.2 / Agosto-2019 | Estacionamientos Únicos de México S.A. de C.V.